# EAGLE schematic rgb-32x16-board (EAGLE 9.4.2)
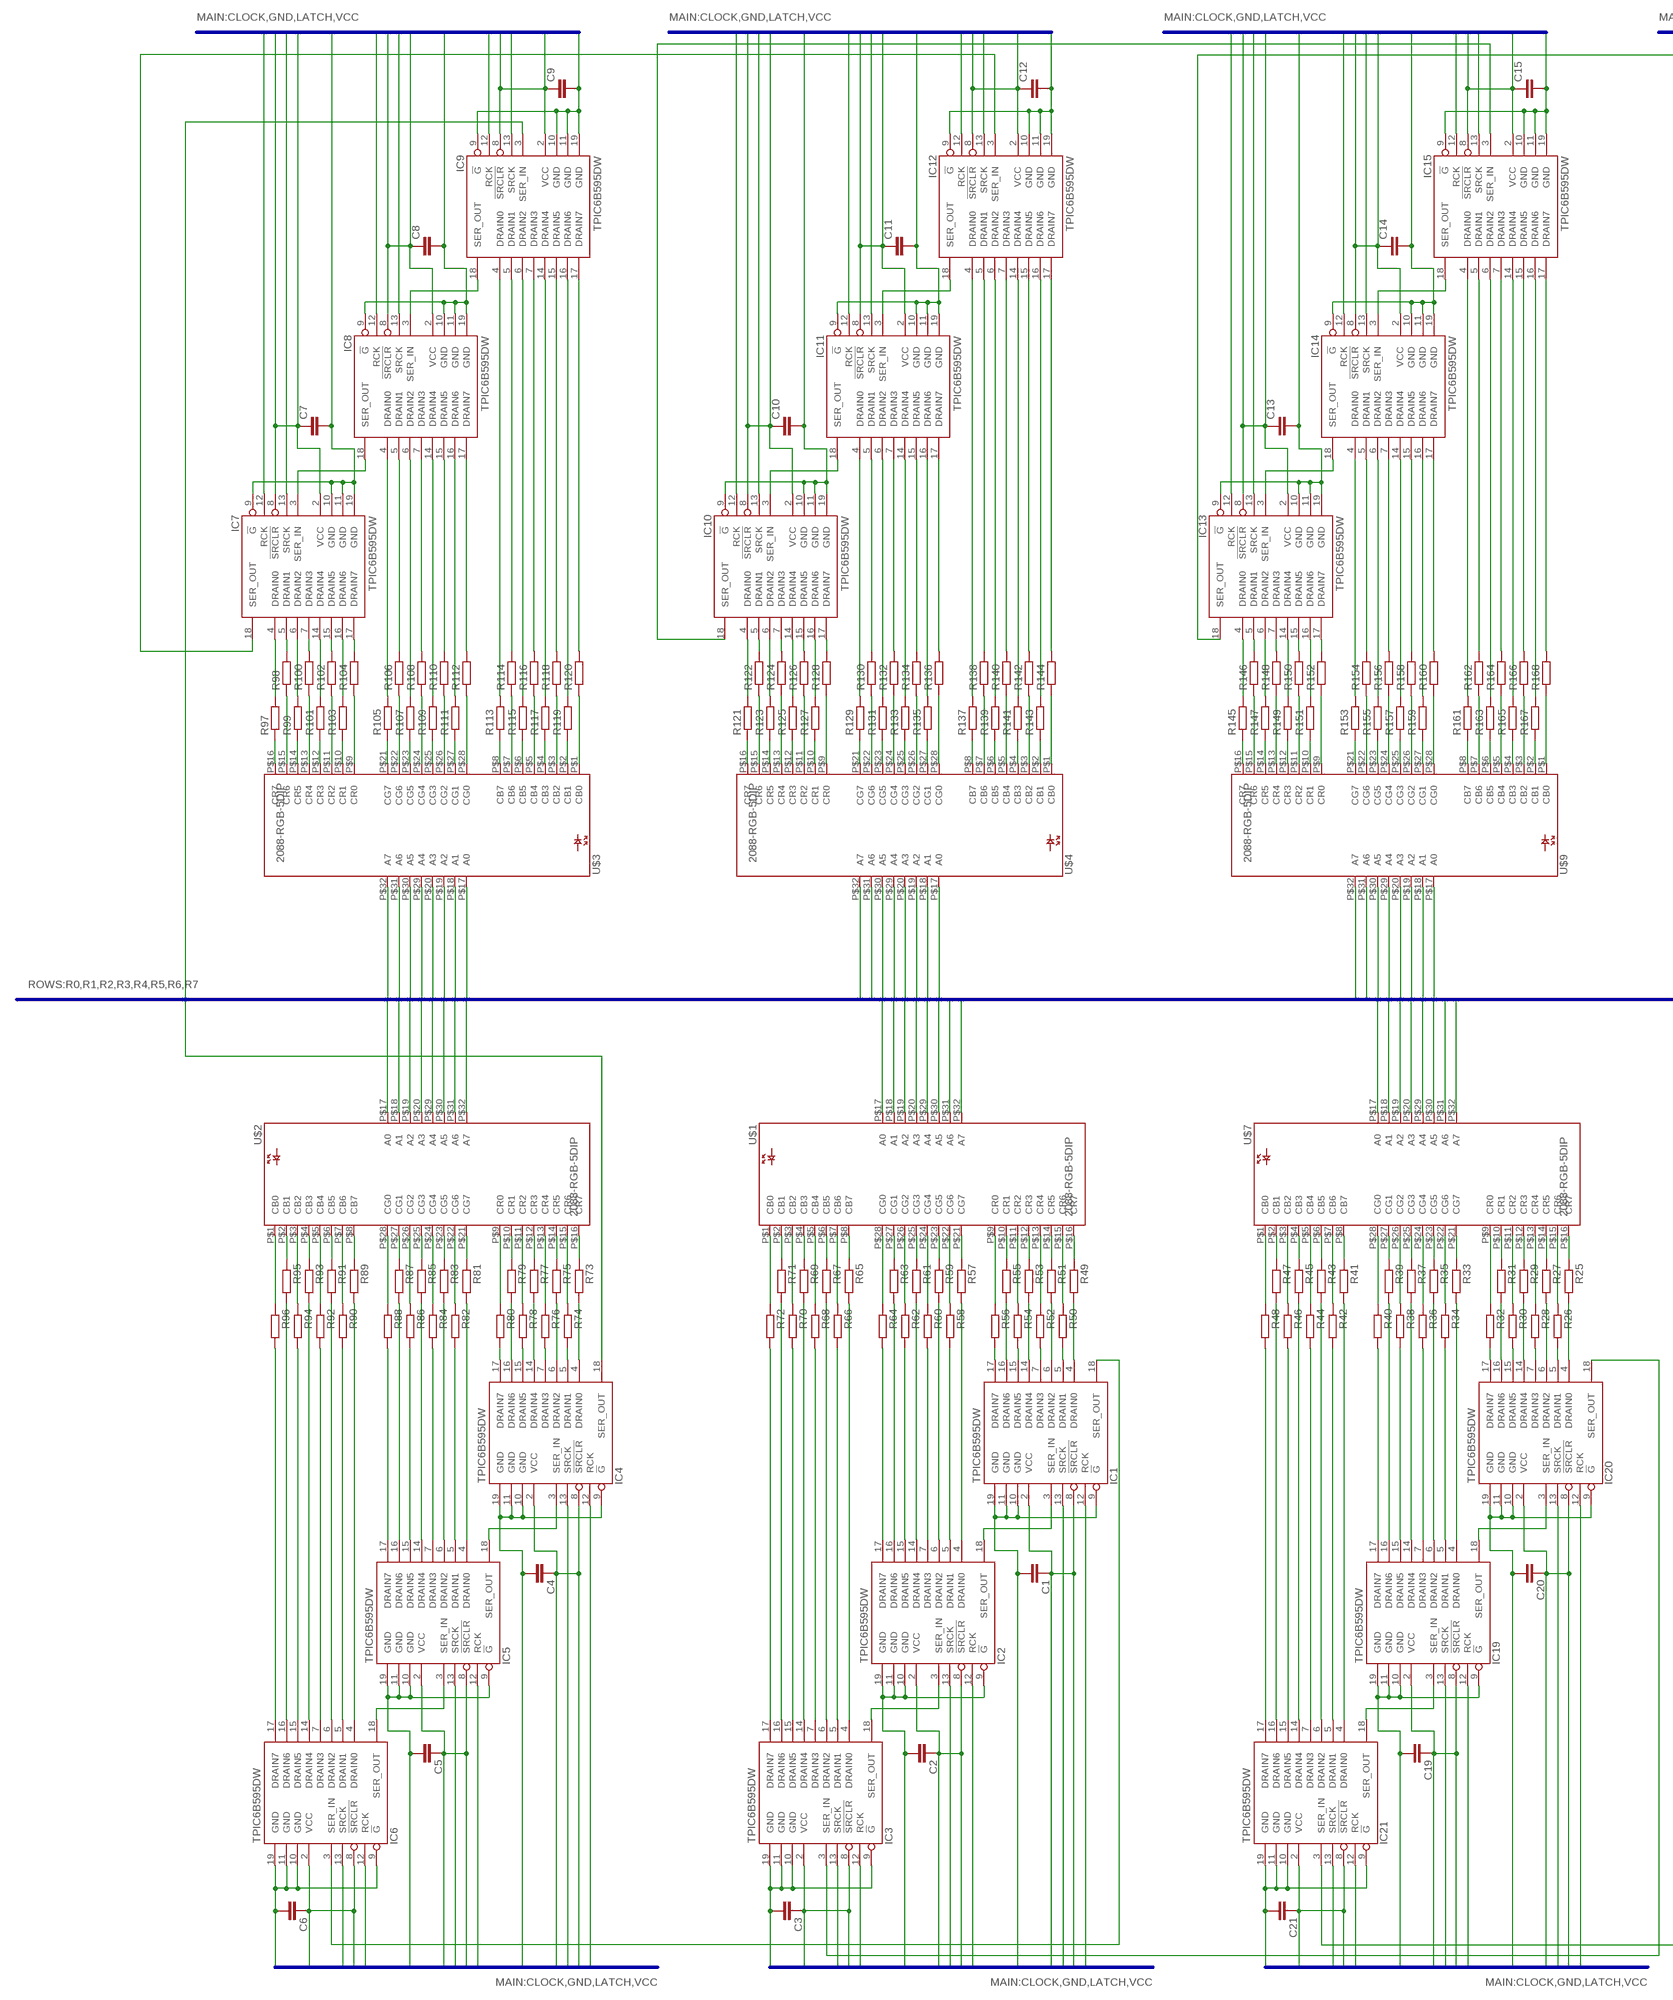
[diagram p0: schematic, sheet 1, part 1 of 2]
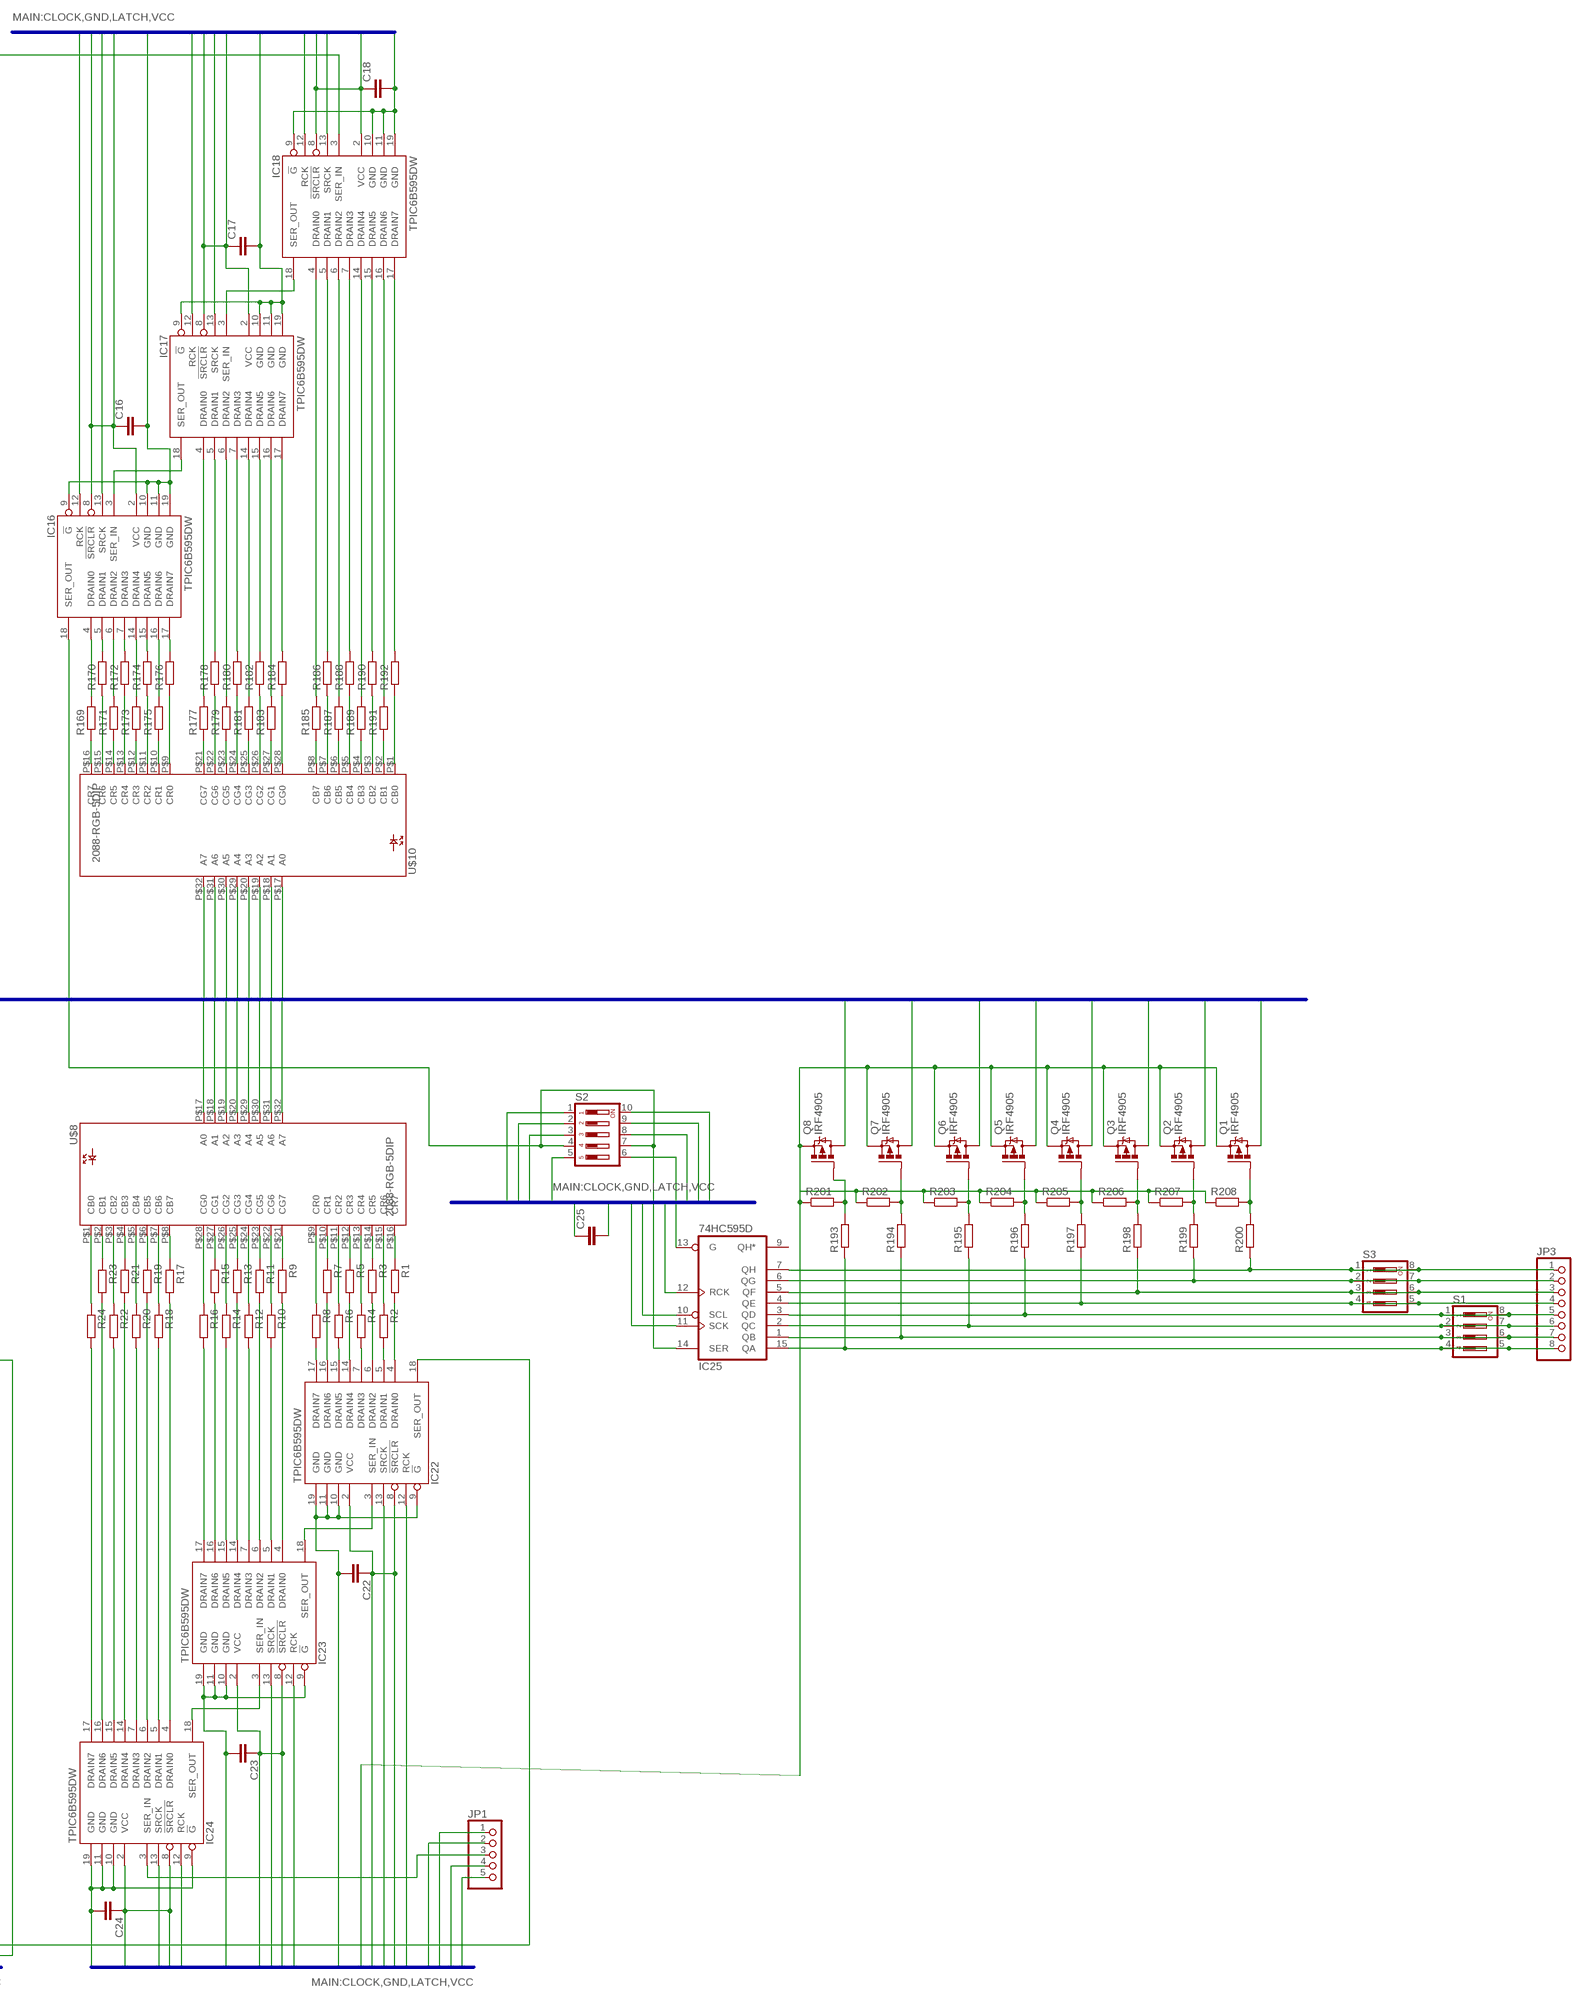
[diagram p1: schematic, sheet 1, part 2 of 2]

## Parts
C1  C-EUC1206  [C1206]
C2  C-EUC1206  [C1206]
C3  C-EUC1206  [C1206]
C4  C-EUC1206  [C1206]
C5  C-EUC1206  [C1206]
C6  C-EUC1206  [C1206]
C7  C-EUC1206  [C1206]
C8  C-EUC1206  [C1206]
C9  C-EUC1206  [C1206]
C10  C-EUC1206  [C1206]
C11  C-EUC1206  [C1206]
C12  C-EUC1206  [C1206]
C13  C-EUC1206  [C1206]
C14  C-EUC1206  [C1206]
C15  C-EUC1206  [C1206]
C16  C-EUC1206  [C1206]
C17  C-EUC1206  [C1206]
C18  C-EUC1206  [C1206]
C19  C-EUC1206  [C1206]
C20  C-EUC1206  [C1206]
C21  C-EUC1206  [C1206]
C22  C-EUC1206  [C1206]
C23  C-EUC1206  [C1206]
C24  C-EUC1206  [C1206]
C25  C-EUC1206  [C1206]
IC1  TPIC6B595DW  [SO20W]
IC2  TPIC6B595DW  [SO20W]
IC3  TPIC6B595DW  [SO20W]
IC4  TPIC6B595DW  [SO20W]
IC5  TPIC6B595DW  [SO20W]
IC6  TPIC6B595DW  [SO20W]
IC7  TPIC6B595DW  [SO20W]
IC8  TPIC6B595DW  [SO20W]
IC9  TPIC6B595DW  [SO20W]
IC10  TPIC6B595DW  [SO20W]
IC11  TPIC6B595DW  [SO20W]
IC12  TPIC6B595DW  [SO20W]
IC13  TPIC6B595DW  [SO20W]
IC14  TPIC6B595DW  [SO20W]
IC15  TPIC6B595DW  [SO20W]
IC16  TPIC6B595DW  [SO20W]
IC17  TPIC6B595DW  [SO20W]
IC18  TPIC6B595DW  [SO20W]
IC19  TPIC6B595DW  [SO20W]
IC20  TPIC6B595DW  [SO20W]
IC21  TPIC6B595DW  [SO20W]
IC22  TPIC6B595DW  [SO20W]
IC23  TPIC6B595DW  [SO20W]
IC24  TPIC6B595DW  [SO20W]
IC25  74HC595D  [SO16]
JP1  PINHD-1X5/90  [1X05/90]
JP3  PINHD-1X8/90  [1X08/90]
Q1  IRF4905  [TO220BH]
Q2  IRF4905  [TO220BH]
Q3  IRF4905  [TO220BH]
Q4  IRF4905  [TO220BH]
Q5  IRF4905  [TO220BH]
Q6  IRF4905  [TO220BH]
Q7  IRF4905  [TO220BH]
Q8  IRF4905  [TO220BH]
R1  R-EU_R1206  [R1206]
R2  R-EU_R1206  [R1206]
R3  R-EU_R1206  [R1206]
R4  R-EU_R1206  [R1206]
R5  R-EU_R1206  [R1206]
R6  R-EU_R1206  [R1206]
R7  R-EU_R1206  [R1206]
R8  R-EU_R1206  [R1206]
R9  R-EU_R1206  [R1206]
R10  R-EU_R1206  [R1206]
R11  R-EU_R1206  [R1206]
R12  R-EU_R1206  [R1206]
R13  R-EU_R1206  [R1206]
R14  R-EU_R1206  [R1206]
R15  R-EU_R1206  [R1206]
R16  R-EU_R1206  [R1206]
R17  R-EU_R1206  [R1206]
R18  R-EU_R1206  [R1206]
R19  R-EU_R1206  [R1206]
R20  R-EU_R1206  [R1206]
R21  R-EU_R1206  [R1206]
R22  R-EU_R1206  [R1206]
R23  R-EU_R1206  [R1206]
R24  R-EU_R1206  [R1206]
R25  R-EU_R1206  [R1206]
R26  R-EU_R1206  [R1206]
R27  R-EU_R1206  [R1206]
R28  R-EU_R1206  [R1206]
R29  R-EU_R1206  [R1206]
R30  R-EU_R1206  [R1206]
R31  R-EU_R1206  [R1206]
R32  R-EU_R1206  [R1206]
R33  R-EU_R1206  [R1206]
R34  R-EU_R1206  [R1206]
R35  R-EU_R1206  [R1206]
R36  R-EU_R1206  [R1206]
R37  R-EU_R1206  [R1206]
R38  R-EU_R1206  [R1206]
R39  R-EU_R1206  [R1206]
R40  R-EU_R1206  [R1206]
R41  R-EU_R1206  [R1206]
R42  R-EU_R1206  [R1206]
R43  R-EU_R1206  [R1206]
R44  R-EU_R1206  [R1206]
R45  R-EU_R1206  [R1206]
R46  R-EU_R1206  [R1206]
R47  R-EU_R1206  [R1206]
R48  R-EU_R1206  [R1206]
R49  R-EU_R1206  [R1206]
R50  R-EU_R1206  [R1206]
R51  R-EU_R1206  [R1206]
R52  R-EU_R1206  [R1206]
R53  R-EU_R1206  [R1206]
R54  R-EU_R1206  [R1206]
R55  R-EU_R1206  [R1206]
R56  R-EU_R1206  [R1206]
R57  R-EU_R1206  [R1206]
R58  R-EU_R1206  [R1206]
R59  R-EU_R1206  [R1206]
R60  R-EU_R1206  [R1206]
R61  R-EU_R1206  [R1206]
R62  R-EU_R1206  [R1206]
R63  R-EU_R1206  [R1206]
R64  R-EU_R1206  [R1206]
R65  R-EU_R1206  [R1206]
R66  R-EU_R1206  [R1206]
R67  R-EU_R1206  [R1206]
R68  R-EU_R1206  [R1206]
R69  R-EU_R1206  [R1206]
R70  R-EU_R1206  [R1206]
R71  R-EU_R1206  [R1206]
R72  R-EU_R1206  [R1206]
R73  R-EU_R1206  [R1206]
R74  R-EU_R1206  [R1206]
R75  R-EU_R1206  [R1206]
R76  R-EU_R1206  [R1206]
R77  R-EU_R1206  [R1206]
R78  R-EU_R1206  [R1206]
R79  R-EU_R1206  [R1206]
R80  R-EU_R1206  [R1206]
R81  R-EU_R1206  [R1206]
R82  R-EU_R1206  [R1206]
R83  R-EU_R1206  [R1206]
R84  R-EU_R1206  [R1206]
R85  R-EU_R1206  [R1206]
R86  R-EU_R1206  [R1206]
R87  R-EU_R1206  [R1206]
R88  R-EU_R1206  [R1206]
R89  R-EU_R1206  [R1206]
R90  R-EU_R1206  [R1206]
R91  R-EU_R1206  [R1206]
R92  R-EU_R1206  [R1206]
R93  R-EU_R1206  [R1206]
R94  R-EU_R1206  [R1206]
R95  R-EU_R1206  [R1206]
R96  R-EU_R1206  [R1206]
R97  R-EU_R1206  [R1206]
R98  R-EU_R1206  [R1206]
R99  R-EU_R1206  [R1206]
R100  R-EU_R1206  [R1206]
R101  R-EU_R1206  [R1206]
R102  R-EU_R1206  [R1206]
R103  R-EU_R1206  [R1206]
R104  R-EU_R1206  [R1206]
R105  R-EU_R1206  [R1206]
R106  R-EU_R1206  [R1206]
R107  R-EU_R1206  [R1206]
R108  R-EU_R1206  [R1206]
R109  R-EU_R1206  [R1206]
R110  R-EU_R1206  [R1206]
R111  R-EU_R1206  [R1206]
R112  R-EU_R1206  [R1206]
R113  R-EU_R1206  [R1206]
R114  R-EU_R1206  [R1206]
R115  R-EU_R1206  [R1206]
R116  R-EU_R1206  [R1206]
R117  R-EU_R1206  [R1206]
R118  R-EU_R1206  [R1206]
R119  R-EU_R1206  [R1206]
R120  R-EU_R1206  [R1206]
R121  R-EU_R1206  [R1206]
R122  R-EU_R1206  [R1206]
R123  R-EU_R1206  [R1206]
R124  R-EU_R1206  [R1206]
R125  R-EU_R1206  [R1206]
R126  R-EU_R1206  [R1206]
R127  R-EU_R1206  [R1206]
R128  R-EU_R1206  [R1206]
R129  R-EU_R1206  [R1206]
R130  R-EU_R1206  [R1206]
R131  R-EU_R1206  [R1206]
R132  R-EU_R1206  [R1206]
R133  R-EU_R1206  [R1206]
R134  R-EU_R1206  [R1206]
R135  R-EU_R1206  [R1206]
R136  R-EU_R1206  [R1206]
R137  R-EU_R1206  [R1206]
R138  R-EU_R1206  [R1206]
R139  R-EU_R1206  [R1206]
R140  R-EU_R1206  [R1206]
R141  R-EU_R1206  [R1206]
R142  R-EU_R1206  [R1206]
R143  R-EU_R1206  [R1206]
R144  R-EU_R1206  [R1206]
R145  R-EU_R1206  [R1206]
R146  R-EU_R1206  [R1206]
R147  R-EU_R1206  [R1206]
R148  R-EU_R1206  [R1206]
R149  R-EU_R1206  [R1206]
R150  R-EU_R1206  [R1206]
R151  R-EU_R1206  [R1206]
R152  R-EU_R1206  [R1206]
R153  R-EU_R1206  [R1206]
R154  R-EU_R1206  [R1206]
R155  R-EU_R1206  [R1206]
R156  R-EU_R1206  [R1206]
R157  R-EU_R1206  [R1206]
R158  R-EU_R1206  [R1206]
R159  R-EU_R1206  [R1206]
R160  R-EU_R1206  [R1206]
R161  R-EU_R1206  [R1206]
R162  R-EU_R1206  [R1206]
R163  R-EU_R1206  [R1206]
R164  R-EU_R1206  [R1206]
R165  R-EU_R1206  [R1206]
R166  R-EU_R1206  [R1206]
R167  R-EU_R1206  [R1206]
R168  R-EU_R1206  [R1206]
R169  R-EU_R1206  [R1206]
R170  R-EU_R1206  [R1206]
R171  R-EU_R1206  [R1206]
R172  R-EU_R1206  [R1206]
R173  R-EU_R1206  [R1206]
R174  R-EU_R1206  [R1206]
R175  R-EU_R1206  [R1206]
R176  R-EU_R1206  [R1206]
R177  R-EU_R1206  [R1206]
R178  R-EU_R1206  [R1206]
R179  R-EU_R1206  [R1206]
R180  R-EU_R1206  [R1206]
R181  R-EU_R1206  [R1206]
R182  R-EU_R1206  [R1206]
R183  R-EU_R1206  [R1206]
R184  R-EU_R1206  [R1206]
R185  R-EU_R1206  [R1206]
R186  R-EU_R1206  [R1206]
R187  R-EU_R1206  [R1206]
R188  R-EU_R1206  [R1206]
R189  R-EU_R1206  [R1206]
R190  R-EU_R1206  [R1206]
R191  R-EU_R1206  [R1206]
R192  R-EU_R1206  [R1206]
R193  R-EU_0207/10  [0207/10]
R194  R-EU_0207/10  [0207/10]
R195  R-EU_0207/10  [0207/10]
R196  R-EU_0207/10  [0207/10]
R197  R-EU_0207/10  [0207/10]
R198  R-EU_0207/10  [0207/10]
R199  R-EU_0207/10  [0207/10]
R200  R-EU_0207/10  [0207/10]
R201  R-EU_R1206  [R1206]
R202  R-EU_R1206  [R1206]
R203  R-EU_R1206  [R1206]
R204  R-EU_R1206  [R1206]
R205  R-EU_R1206  [R1206]
R206  R-EU_R1206  [R1206]
R207  R-EU_R1206  [R1206]
R208  R-EU_R1206  [R1206]
S1  DIP04YL  [DIP04YL]
S2  DIP05YL  [DIP05YL]
S3  DIP04YL  [DIP04YL]
U$1  2088-RGB-5DIP  [2088-RGB-5]
U$2  2088-RGB-5DIP  [2088-RGB-5]
U$3  2088-RGB-5DIP  [2088-RGB-5]
U$4  2088-RGB-5DIP  [2088-RGB-5]
U$7  2088-RGB-5DIP  [2088-RGB-5]
U$8  2088-RGB-5DIP  [2088-RGB-5]
U$9  2088-RGB-5DIP  [2088-RGB-5]
U$10  2088-RGB-5DIP  [2088-RGB-5]

## Nets
CLOCK: IC1.13(SRCK) IC2.13(SRCK) IC3.13(SRCK) IC4.13(SRCK) IC5.13(SRCK) IC6.13(SRCK) IC7.13(SRCK) IC8.13(SRCK) IC9.13(SRCK) IC10.13(SRCK) IC11.13(SRCK) IC12.13(SRCK) IC13.13(SRCK) IC14.13(SRCK) IC15.13(SRCK) IC16.13(SRCK) IC17.13(SRCK) IC18.13(SRCK) IC19.13(SRCK) IC20.13(SRCK) IC21.13(SRCK) IC22.13(SRCK) IC23.13(SRCK) IC24.13(SRCK) IC25.11(SCK) JP1.2 S2.2 S2.9
GND: C1.2 C2.2 C3.2 C4.2 C5.2 C6.2 C7.2 C8.2 C9.2 C10.2 C11.2 C12.2 C13.2 C14.2 C15.2 C16.2 C17.2 C18.2 C19.2 C20.2 C21.2 C22.2 C23.2 C24.2 C25.2 IC1.9(!G) IC1.10(GND) IC1.11(GND) IC1.19(GND) IC2.9(!G) IC2.10(GND) IC2.11(GND) IC2.19(GND) IC3.9(!G) IC3.10(GND) IC3.11(GND) IC3.19(GND) IC4.9(!G) IC4.10(GND) IC4.11(GND) IC4.19(GND) IC5.9(!G) IC5.10(GND) IC5.11(GND) IC5.19(GND) IC6.9(!G) IC6.10(GND) IC6.11(GND) IC6.19(GND) IC7.9(!G) IC7.10(GND) IC7.11(GND) IC7.19(GND) IC8.9(!G) IC8.10(GND) IC8.11(GND) IC8.19(GND) IC9.9(!G) IC9.10(GND) IC9.11(GND) IC9.19(GND) IC10.9(!G) IC10.10(GND) IC10.11(GND) IC10.19(GND) IC11.9(!G) IC11.10(GND) IC11.11(GND) IC11.19(GND) IC12.9(!G) IC12.10(GND) IC12.11(GND) IC12.19(GND) IC13.9(!G) IC13.10(GND) IC13.11(GND) IC13.19(GND) IC14.9(!G) IC14.10(GND) IC14.11(GND) IC14.19(GND) IC15.9(!G) IC15.10(GND) IC15.11(GND) IC15.19(GND) IC16.9(!G) IC16.10(GND) IC16.11(GND) IC16.19(GND) IC17.9(!G) IC17.10(GND) IC17.11(GND) IC17.19(GND) IC18.9(!G) IC18.10(GND) IC18.11(GND) IC18.19(GND) IC19.9(!G) IC19.10(GND) IC19.11(GND) IC19.19(GND) IC20.9(!G) IC20.10(GND) IC20.11(GND) IC20.19(GND) IC21.9(!G) IC21.10(GND) IC21.11(GND) IC21.19(GND) IC22.9(!G) IC22.10(GND) IC22.11(GND) IC22.19(GND) IC23.9(!G) IC23.10(GND) IC23.11(GND) IC23.19(GND) IC24.9(!G) IC24.10(GND) IC24.11(GND) IC24.19(GND) IC25.13(G) JP1.5 S2.1 S2.10
LATCH: IC1.12(RCK) IC2.12(RCK) IC3.12(RCK) IC4.12(RCK) IC5.12(RCK) IC6.12(RCK) IC7.12(RCK) IC8.12(RCK) IC9.12(RCK) IC10.12(RCK) IC11.12(RCK) IC12.12(RCK) IC13.12(RCK) IC14.12(RCK) IC15.12(RCK) IC16.12(RCK) IC17.12(RCK) IC18.12(RCK) IC19.12(RCK) IC20.12(RCK) IC21.12(RCK) IC22.12(RCK) IC23.12(RCK) IC24.12(RCK) IC25.12(RCK) JP1.1 S2.3 S2.8
N$1: R1.1 U$8.P$16(CR7)
N$2: R3.1 U$8.P$14(CR5)
N$3: R5.1 U$8.P$12(CR3)
N$4: R7.1 U$8.P$10(CR1)
N$5: R9.1 U$8.P$21(CG7)
N$6: R11.1 U$8.P$23(CG5)
N$7: R13.1 U$8.P$25(CG3)
N$8: R15.1 U$8.P$27(CG1)
N$9: IC22.17(DRAIN7) R8.2
N$10: IC22.16(DRAIN6) R7.2
N$11: IC22.15(DRAIN5) R6.2
N$12: IC22.14(DRAIN4) R5.2
N$13: IC22.7(DRAIN3) R4.2
N$14: IC22.6(DRAIN2) R3.2
N$15: IC22.5(DRAIN1) R2.2
N$16: IC22.4(DRAIN0) R1.2
N$17: IC23.4(DRAIN0) R9.2
N$18: IC23.5(DRAIN1) R10.2
N$19: IC23.6(DRAIN2) R11.2
N$20: IC23.7(DRAIN3) R12.2
N$21: IC23.14(DRAIN4) R13.2
N$22: IC23.15(DRAIN5) R14.2
N$23: IC23.16(DRAIN6) R15.2
N$24: IC23.17(DRAIN7) R16.2
N$25: IC24.4(DRAIN0) R17.2
N$26: IC24.5(DRAIN1) R18.2
N$27: IC24.6(DRAIN2) R19.2
N$28: IC24.7(DRAIN3) R20.2
N$29: IC24.14(DRAIN4) R21.2
N$30: IC24.15(DRAIN5) R22.2
N$31: IC24.16(DRAIN6) R23.2
N$32: IC24.17(DRAIN7) R24.2
N$33: R17.1 U$8.P$8(CB7)
N$34: R19.1 U$8.P$6(CB5)
N$35: R21.1 U$8.P$4(CB3)
N$36: R23.1 U$8.P$2(CB1)
N$37: R2.1 U$8.P$15(CR6)
N$38: R4.1 U$8.P$13(CR4)
N$39: R6.1 U$8.P$11(CR2)
N$40: R8.1 U$8.P$9(CR0)
N$41: R10.1 U$8.P$22(CG6)
N$42: R12.1 U$8.P$24(CG4)
N$43: R14.1 U$8.P$26(CG2)
N$44: R16.1 U$8.P$28(CG0)
N$45: R18.1 U$8.P$7(CB6)
N$46: R20.1 U$8.P$5(CB4)
N$47: R22.1 U$8.P$3(CB2)
N$48: R24.1 U$8.P$1(CB0)
N$49: IC21.3(SER_IN) IC22.18(SER_OUT)
N$50: IC22.3(SER_IN) IC23.18(SER_OUT)
N$51: IC20.17(DRAIN7) R32.2
N$52: IC23.3(SER_IN) IC24.18(SER_OUT)
N$53: IC24.3(SER_IN) JP1.3
N$54: IC20.16(DRAIN6) R31.2
N$55: IC20.15(DRAIN5) R30.2
N$56: IC20.14(DRAIN4) R29.2
N$57: IC20.7(DRAIN3) R28.2
N$58: IC20.6(DRAIN2) R27.2
N$59: IC20.5(DRAIN1) R26.2
N$60: IC20.4(DRAIN0) R25.2
N$61: IC19.4(DRAIN0) R33.2
N$62: IC19.5(DRAIN1) R34.2
N$63: IC19.6(DRAIN2) R35.2
N$64: IC19.7(DRAIN3) R36.2
N$65: IC19.14(DRAIN4) R37.2
N$66: IC19.15(DRAIN5) R38.2
N$67: IC19.16(DRAIN6) R39.2
N$68: IC19.17(DRAIN7) R40.2
N$69: IC21.4(DRAIN0) R41.2
N$70: IC21.5(DRAIN1) R42.2
N$71: IC21.6(DRAIN2) R43.2
N$72: IC21.7(DRAIN3) R44.2
N$73: IC21.14(DRAIN4) R45.2
N$74: IC21.15(DRAIN5) R46.2
N$75: IC21.16(DRAIN6) R47.2
N$76: IC21.17(DRAIN7) R48.2
N$77: R25.1 U$7.P$16(CR7)
N$78: R27.1 U$7.P$14(CR5)
N$79: R29.1 U$7.P$12(CR3)
N$80: R31.1 U$7.P$10(CR1)
N$81: R33.1 U$7.P$21(CG7)
N$82: R35.1 U$7.P$23(CG5)
N$83: R37.1 U$7.P$25(CG3)
N$84: R39.1 U$7.P$27(CG1)
N$85: R41.1 U$7.P$8(CB7)
N$86: R43.1 U$7.P$6(CB5)
N$87: R45.1 U$7.P$4(CB3)
N$88: R47.1 U$7.P$2(CB1)
N$89: R26.1 U$7.P$15(CR6)
N$90: R28.1 U$7.P$13(CR4)
N$91: R30.1 U$7.P$11(CR2)
N$92: R32.1 U$7.P$9(CR0)
N$93: R34.1 U$7.P$22(CG6)
N$94: R36.1 U$7.P$24(CG4)
N$95: R38.1 U$7.P$26(CG2)
N$96: R40.1 U$7.P$28(CG0)
N$97: R42.1 U$7.P$7(CB6)
N$98: R44.1 U$7.P$5(CB4)
N$99: R46.1 U$7.P$3(CB2)
N$100: R48.1 U$7.P$1(CB0)
N$101: IC19.3(SER_IN) IC21.18(SER_OUT)
N$102: IC19.18(SER_OUT) IC20.3(SER_IN)
N$103: IC3.3(SER_IN) IC20.18(SER_OUT)
N$104: IC1.17(DRAIN7) R56.2
N$105: IC1.16(DRAIN6) R55.2
N$106: IC1.15(DRAIN5) R54.2
N$107: IC1.14(DRAIN4) R53.2
N$108: IC1.7(DRAIN3) R52.2
N$109: IC1.6(DRAIN2) R51.2
N$110: IC1.5(DRAIN1) R50.2
N$111: IC1.4(DRAIN0) R49.2
N$112: IC2.4(DRAIN0) R57.2
N$113: IC2.5(DRAIN1) R58.2
N$114: IC2.6(DRAIN2) R59.2
N$115: IC2.7(DRAIN3) R60.2
N$116: IC2.14(DRAIN4) R61.2
N$117: IC2.15(DRAIN5) R62.2
N$118: IC2.16(DRAIN6) R63.2
N$119: IC2.17(DRAIN7) R64.2
N$120: IC3.4(DRAIN0) R65.2
N$121: IC3.5(DRAIN1) R66.2
N$122: IC3.6(DRAIN2) R67.2
N$123: IC3.7(DRAIN3) R68.2
N$124: IC3.14(DRAIN4) R69.2
N$125: IC3.15(DRAIN5) R70.2
N$126: IC3.16(DRAIN6) R71.2
N$127: IC3.17(DRAIN7) R72.2
N$128: IC1.18(SER_OUT) IC6.3(SER_IN)
N$129: R49.1 U$1.P$16(CR7)
N$130: R51.1 U$1.P$14(CR5)
N$131: R53.1 U$1.P$12(CR3)
N$132: R55.1 U$1.P$10(CR1)
N$133: R57.1 U$1.P$21(CG7)
N$134: R59.1 U$1.P$23(CG5)
N$135: R61.1 U$1.P$25(CG3)
N$136: R63.1 U$1.P$27(CG1)
N$137: R65.1 U$1.P$8(CB7)
N$138: R67.1 U$1.P$6(CB5)
N$139: R69.1 U$1.P$4(CB3)
N$140: R71.1 U$1.P$2(CB1)
N$141: R50.1 U$1.P$15(CR6)
N$142: R52.1 U$1.P$13(CR4)
N$143: R54.1 U$1.P$11(CR2)
N$144: R56.1 U$1.P$9(CR0)
N$145: R58.1 U$1.P$22(CG6)
N$146: R60.1 U$1.P$24(CG4)
N$147: R62.1 U$1.P$26(CG2)
N$148: R64.1 U$1.P$28(CG0)
N$149: R66.1 U$1.P$7(CB6)
N$150: R68.1 U$1.P$5(CB4)
N$151: R70.1 U$1.P$3(CB2)
N$152: R72.1 U$1.P$1(CB0)
N$153: IC2.3(SER_IN) IC3.18(SER_OUT)
N$154: IC4.17(DRAIN7) R80.2
N$155: IC1.3(SER_IN) IC2.18(SER_OUT)
N$156: IC4.16(DRAIN6) R79.2
N$157: IC4.15(DRAIN5) R78.2
N$158: IC4.14(DRAIN4) R77.2
N$159: IC4.7(DRAIN3) R76.2
N$160: IC4.6(DRAIN2) R75.2
N$161: IC4.5(DRAIN1) R74.2
N$162: IC4.4(DRAIN0) R73.2
N$163: IC5.4(DRAIN0) R81.2
N$164: IC5.5(DRAIN1) R82.2
N$165: IC5.6(DRAIN2) R83.2
N$166: IC5.7(DRAIN3) R84.2
N$167: IC5.14(DRAIN4) R85.2
N$168: IC5.15(DRAIN5) R86.2
N$169: IC5.16(DRAIN6) R87.2
N$170: IC5.17(DRAIN7) R88.2
N$171: IC6.4(DRAIN0) R89.2
N$172: IC6.5(DRAIN1) R90.2
N$173: IC6.6(DRAIN2) R91.2
N$174: IC6.7(DRAIN3) R92.2
N$175: IC6.14(DRAIN4) R93.2
N$176: IC6.15(DRAIN5) R94.2
N$177: IC6.16(DRAIN6) R95.2
N$178: IC6.17(DRAIN7) R96.2
N$179: R73.1 U$2.P$16(CR7)
N$180: R75.1 U$2.P$14(CR5)
N$181: R77.1 U$2.P$12(CR3)
N$182: R79.1 U$2.P$10(CR1)
N$183: R81.1 U$2.P$21(CG7)
N$184: R83.1 U$2.P$23(CG5)
N$185: R85.1 U$2.P$25(CG3)
N$186: R87.1 U$2.P$27(CG1)
N$187: R89.1 U$2.P$8(CB7)
N$188: R91.1 U$2.P$6(CB5)
N$189: R93.1 U$2.P$4(CB3)
N$190: R95.1 U$2.P$2(CB1)
N$191: R74.1 U$2.P$15(CR6)
N$192: R76.1 U$2.P$13(CR4)
N$193: R78.1 U$2.P$11(CR2)
N$194: R80.1 U$2.P$9(CR0)
N$195: R82.1 U$2.P$22(CG6)
N$196: R84.1 U$2.P$24(CG4)
N$197: R86.1 U$2.P$26(CG2)
N$198: R88.1 U$2.P$28(CG0)
N$199: R90.1 U$2.P$7(CB6)
N$200: R92.1 U$2.P$5(CB4)
N$201: R94.1 U$2.P$3(CB2)
N$202: R96.1 U$2.P$1(CB0)
N$203: IC5.3(SER_IN) IC6.18(SER_OUT)
N$204: IC4.3(SER_IN) IC5.18(SER_OUT)
N$205: IC7.17(DRAIN7) R104.2
N$206: IC7.16(DRAIN6) R103.2
N$207: IC7.15(DRAIN5) R102.2
N$208: IC7.14(DRAIN4) R101.2
N$209: IC7.7(DRAIN3) R100.2
N$210: IC7.6(DRAIN2) R99.2
N$211: IC7.5(DRAIN1) R98.2
N$212: IC7.4(DRAIN0) R97.2
N$213: IC8.4(DRAIN0) R105.2
N$214: IC8.5(DRAIN1) R106.2
N$215: IC8.6(DRAIN2) R107.2
N$216: IC8.7(DRAIN3) R108.2
N$217: IC8.14(DRAIN4) R109.2
N$218: IC8.15(DRAIN5) R110.2
N$219: IC8.16(DRAIN6) R111.2
N$220: IC8.17(DRAIN7) R112.2
N$221: IC9.4(DRAIN0) R113.2
N$222: IC9.5(DRAIN1) R114.2
N$223: IC9.6(DRAIN2) R115.2
N$224: IC9.7(DRAIN3) R116.2
N$225: IC9.14(DRAIN4) R117.2
N$226: IC9.15(DRAIN5) R118.2
N$227: IC9.16(DRAIN6) R119.2
N$228: IC9.17(DRAIN7) R120.2
N$229: IC4.18(SER_OUT) IC9.3(SER_IN)
N$230: R97.1 U$3.P$16(CR7)
N$231: R99.1 U$3.P$14(CR5)
N$232: R101.1 U$3.P$12(CR3)
N$233: R103.1 U$3.P$10(CR1)
N$234: R105.1 U$3.P$21(CG7)
N$235: R107.1 U$3.P$23(CG5)
N$236: R109.1 U$3.P$25(CG3)
N$237: R111.1 U$3.P$27(CG1)
N$238: R113.1 U$3.P$8(CB7)
N$239: R115.1 U$3.P$6(CB5)
N$240: R117.1 U$3.P$4(CB3)
N$241: R119.1 U$3.P$2(CB1)
N$242: R98.1 U$3.P$15(CR6)
N$243: R100.1 U$3.P$13(CR4)
N$244: R102.1 U$3.P$11(CR2)
N$245: R104.1 U$3.P$9(CR0)
N$246: R106.1 U$3.P$22(CG6)
N$247: R108.1 U$3.P$24(CG4)
N$248: R110.1 U$3.P$26(CG2)
N$249: R112.1 U$3.P$28(CG0)
N$250: R114.1 U$3.P$7(CB6)
N$251: R116.1 U$3.P$5(CB4)
N$252: R118.1 U$3.P$3(CB2)
N$253: R120.1 U$3.P$1(CB0)
N$254: IC10.17(DRAIN7) R128.2
N$255: IC10.16(DRAIN6) R127.2
N$256: IC10.15(DRAIN5) R126.2
N$257: IC10.14(DRAIN4) R125.2
N$258: IC10.7(DRAIN3) R124.2
N$259: IC10.6(DRAIN2) R123.2
N$260: IC10.5(DRAIN1) R122.2
N$261: IC10.4(DRAIN0) R121.2
N$262: IC11.4(DRAIN0) R129.2
N$263: IC11.5(DRAIN1) R130.2
N$264: IC11.6(DRAIN2) R131.2
N$265: IC11.7(DRAIN3) R132.2
N$266: IC11.14(DRAIN4) R133.2
N$267: IC11.15(DRAIN5) R134.2
N$268: IC11.16(DRAIN6) R135.2
N$269: IC11.17(DRAIN7) R136.2
N$270: IC12.4(DRAIN0) R137.2
N$271: IC12.5(DRAIN1) R138.2
N$272: IC12.6(DRAIN2) R139.2
N$273: IC12.7(DRAIN3) R140.2
N$274: IC12.14(DRAIN4) R141.2
N$275: IC12.15(DRAIN5) R142.2
N$276: IC12.16(DRAIN6) R143.2
N$277: IC12.17(DRAIN7) R144.2
N$278: IC7.18(SER_OUT) IC12.3(SER_IN)
N$279: IC7.3(SER_IN) IC8.18(SER_OUT)
N$280: IC8.3(SER_IN) IC9.18(SER_OUT)
N$281: R121.1 U$4.P$16(CR7)
N$282: R123.1 U$4.P$14(CR5)
N$283: R125.1 U$4.P$12(CR3)
N$284: R127.1 U$4.P$10(CR1)
N$285: R129.1 U$4.P$21(CG7)
N$286: R131.1 U$4.P$23(CG5)
N$287: R133.1 U$4.P$25(CG3)
N$288: R135.1 U$4.P$27(CG1)
N$289: R137.1 U$4.P$8(CB7)
N$290: R139.1 U$4.P$6(CB5)
N$291: R141.1 U$4.P$4(CB3)
N$292: R143.1 U$4.P$2(CB1)
N$293: R122.1 U$4.P$15(CR6)
N$294: R124.1 U$4.P$13(CR4)
N$295: R126.1 U$4.P$11(CR2)
N$296: R128.1 U$4.P$9(CR0)
N$297: R130.1 U$4.P$22(CG6)
N$298: R132.1 U$4.P$24(CG4)
N$299: R134.1 U$4.P$26(CG2)
N$300: R136.1 U$4.P$28(CG0)
N$301: R138.1 U$4.P$7(CB6)
N$302: R140.1 U$4.P$5(CB4)
N$303: R142.1 U$4.P$3(CB2)
N$304: R144.1 U$4.P$1(CB0)
N$305: IC11.3(SER_IN) IC12.18(SER_OUT)
N$306: IC10.18(SER_OUT) IC15.3(SER_IN)
N$307: IC10.3(SER_IN) IC11.18(SER_OUT)
N$308: IC13.17(DRAIN7) R152.2
N$309: IC13.16(DRAIN6) R151.2
N$310: IC13.15(DRAIN5) R150.2
N$311: IC13.14(DRAIN4) R149.2
N$312: IC13.7(DRAIN3) R148.2
N$313: IC13.6(DRAIN2) R147.2
N$314: IC13.5(DRAIN1) R146.2
N$315: IC13.4(DRAIN0) R145.2
N$316: IC14.4(DRAIN0) R153.2
N$317: IC14.5(DRAIN1) R154.2
N$318: IC14.6(DRAIN2) R155.2
N$319: IC14.7(DRAIN3) R156.2
N$320: IC14.14(DRAIN4) R157.2
N$321: IC14.15(DRAIN5) R158.2
N$322: IC14.16(DRAIN6) R159.2
N$323: IC14.17(DRAIN7) R160.2
N$324: IC15.4(DRAIN0) R161.2
N$325: IC15.5(DRAIN1) R162.2
N$326: IC15.6(DRAIN2) R163.2
N$327: IC15.7(DRAIN3) R164.2
N$328: IC15.14(DRAIN4) R165.2
N$329: IC15.15(DRAIN5) R166.2
N$330: IC15.16(DRAIN6) R167.2
N$331: IC15.17(DRAIN7) R168.2
N$332: R145.1 U$9.P$16(CR7)
N$333: R147.1 U$9.P$14(CR5)
N$334: R149.1 U$9.P$12(CR3)
N$335: R151.1 U$9.P$10(CR1)
N$336: R153.1 U$9.P$21(CG7)
N$337: R155.1 U$9.P$23(CG5)
N$338: R157.1 U$9.P$25(CG3)
N$339: R159.1 U$9.P$27(CG1)
N$340: R161.1 U$9.P$8(CB7)
N$341: R163.1 U$9.P$6(CB5)
N$342: R165.1 U$9.P$4(CB3)
N$343: R167.1 U$9.P$2(CB1)
N$344: R146.1 U$9.P$15(CR6)
N$345: R148.1 U$9.P$13(CR4)
N$346: R150.1 U$9.P$11(CR2)
N$347: R152.1 U$9.P$9(CR0)
N$348: R154.1 U$9.P$22(CG6)
N$349: R156.1 U$9.P$24(CG4)
N$350: R158.1 U$9.P$26(CG2)
N$351: R160.1 U$9.P$28(CG0)
N$352: R162.1 U$9.P$7(CB6)
N$353: R164.1 U$9.P$5(CB4)
N$354: R166.1 U$9.P$3(CB2)
N$355: R168.1 U$9.P$1(CB0)
N$356: IC14.3(SER_IN) IC15.18(SER_OUT)
N$357: IC13.3(SER_IN) IC14.18(SER_OUT)
N$358: IC16.17(DRAIN7) R176.2
N$359: IC16.16(DRAIN6) R175.2
N$360: IC16.15(DRAIN5) R174.2
N$361: IC16.14(DRAIN4) R173.2
N$362: IC16.7(DRAIN3) R172.2
N$363: IC16.6(DRAIN2) R171.2
N$364: IC16.5(DRAIN1) R170.2
N$365: IC16.4(DRAIN0) R169.2
N$366: IC17.4(DRAIN0) R177.2
N$367: IC17.5(DRAIN1) R178.2
N$368: IC17.6(DRAIN2) R179.2
N$369: IC17.7(DRAIN3) R180.2
N$370: IC17.14(DRAIN4) R181.2
N$371: IC17.15(DRAIN5) R182.2
N$372: IC17.16(DRAIN6) R183.2
N$373: IC17.17(DRAIN7) R184.2
N$374: IC18.4(DRAIN0) R185.2
N$375: IC18.5(DRAIN1) R186.2
N$376: IC18.6(DRAIN2) R187.2
N$377: IC18.7(DRAIN3) R188.2
N$378: IC18.14(DRAIN4) R189.2
N$379: IC18.15(DRAIN5) R190.2
N$380: IC18.16(DRAIN6) R191.2
N$381: IC18.17(DRAIN7) R192.2
N$382: R169.1 U$10.P$16(CR7)
N$383: R171.1 U$10.P$14(CR5)
N$384: R173.1 U$10.P$12(CR3)
N$385: R175.1 U$10.P$10(CR1)
N$386: R177.1 U$10.P$21(CG7)
N$387: R179.1 U$10.P$23(CG5)
N$388: R181.1 U$10.P$25(CG3)
N$389: R183.1 U$10.P$27(CG1)
N$390: R185.1 U$10.P$8(CB7)
N$391: R187.1 U$10.P$6(CB5)
N$392: R189.1 U$10.P$4(CB3)
N$393: R191.1 U$10.P$2(CB1)
N$394: R170.1 U$10.P$15(CR6)
N$395: R172.1 U$10.P$13(CR4)
N$396: R174.1 U$10.P$11(CR2)
N$397: R176.1 U$10.P$9(CR0)
N$398: R178.1 U$10.P$22(CG6)
N$399: R180.1 U$10.P$24(CG4)
N$400: R182.1 U$10.P$26(CG2)
N$401: R184.1 U$10.P$28(CG0)
N$402: R186.1 U$10.P$7(CB6)
N$403: R188.1 U$10.P$5(CB4)
N$404: R190.1 U$10.P$3(CB2)
N$405: R192.1 U$10.P$1(CB0)
N$406: IC17.3(SER_IN) IC18.18(SER_OUT)
N$407: IC16.3(SER_IN) IC17.18(SER_OUT)
N$408: IC13.18(SER_OUT) IC18.3(SER_IN)
N$409: Q8.G R193.2 R201.2
N$410: Q7.G R194.2 R202.2
N$411: Q6.G R195.2 R203.2
N$412: Q5.G R196.2 R204.2
N$413: Q4.G R197.2 R205.2
N$414: Q3.G R198.2 R206.2
N$415: Q2.G R199.2 R207.2
N$416: Q1.G R200.2 R208.2
N$417: IC25.15(QA) JP3.8 R193.1 S1.4 S1.5
N$419: IC25.1(QB) JP3.7 R194.1 S1.3 S1.6
N$421: IC25.3(QD) JP3.5 R196.1 S1.1 S1.8
N$422: IC25.4(QE) JP3.4 R197.1 S3.4 S3.5
N$423: IC25.5(QF) JP3.3 R198.1 S3.3 S3.6
N$425: IC25.7(QH) JP3.1 R200.1 S3.1 S3.8
N$426: IC16.18(SER_OUT) IC25.14(SER) S2.4 S2.7
N$427: IC25.6(QG) JP3.2 R199.1 S3.2 S3.7
N$428: IC25.2(QC) JP3.6 R195.1 S1.2 S1.7
R0: Q8.D U$1.P$17(A0) U$2.P$17(A0) U$3.P$32(A7) U$4.P$32(A7) U$7.P$17(A0) U$8.P$17(A0) U$9.P$32(A7) U$10.P$32(A7)
R1: Q7.D U$1.P$18(A1) U$2.P$18(A1) U$3.P$31(A6) U$4.P$31(A6) U$7.P$18(A1) U$8.P$18(A1) U$9.P$31(A6) U$10.P$31(A6)
R2: Q6.D U$1.P$19(A2) U$2.P$19(A2) U$3.P$30(A5) U$4.P$30(A5) U$7.P$19(A2) U$8.P$19(A2) U$9.P$30(A5) U$10.P$30(A5)
R3: Q5.D U$1.P$20(A3) U$2.P$20(A3) U$3.P$29(A4) U$4.P$29(A4) U$7.P$20(A3) U$8.P$20(A3) U$9.P$29(A4) U$10.P$29(A4)
R4: Q4.D U$1.P$29(A4) U$2.P$29(A4) U$3.P$20(A3) U$4.P$20(A3) U$7.P$29(A4) U$8.P$29(A4) U$9.P$20(A3) U$10.P$20(A3)
R5: Q3.D U$1.P$30(A5) U$2.P$30(A5) U$3.P$19(A2) U$4.P$19(A2) U$7.P$30(A5) U$8.P$30(A5) U$9.P$19(A2) U$10.P$19(A2)
R6: Q2.D U$1.P$31(A6) U$2.P$31(A6) U$3.P$18(A1) U$4.P$18(A1) U$7.P$31(A6) U$8.P$31(A6) U$9.P$18(A1) U$10.P$18(A1)
R7: Q1.D U$1.P$32(A7) U$2.P$32(A7) U$3.P$17(A0) U$4.P$17(A0) U$7.P$32(A7) U$8.P$32(A7) U$9.P$17(A0) U$10.P$17(A0)
VCC: C1.1 C2.1 C3.1 C4.1 C5.1 C6.1 C7.1 C8.1 C9.1 C10.1 C11.1 C12.1 C13.1 C14.1 C15.1 C16.1 C17.1 C18.1 C19.1 C20.1 C21.1 C22.1 C23.1 C24.1 C25.1 IC1.2(VCC) IC1.8(!SRCLR) IC2.2(VCC) IC2.8(!SRCLR) IC3.2(VCC) IC3.8(!SRCLR) IC4.2(VCC) IC4.8(!SRCLR) IC5.2(VCC) IC5.8(!SRCLR) IC6.2(VCC) IC6.8(!SRCLR) IC7.2(VCC) IC7.8(!SRCLR) IC8.2(VCC) IC8.8(!SRCLR) IC9.2(VCC) IC9.8(!SRCLR) IC10.2(VCC) IC10.8(!SRCLR) IC11.2(VCC) IC11.8(!SRCLR) IC12.2(VCC) IC12.8(!SRCLR) IC13.2(VCC) IC13.8(!SRCLR) IC14.2(VCC) IC14.8(!SRCLR) IC15.2(VCC) IC15.8(!SRCLR) IC16.2(VCC) IC16.8(!SRCLR) IC17.2(VCC) IC17.8(!SRCLR) IC18.2(VCC) IC18.8(!SRCLR) IC19.2(VCC) IC19.8(!SRCLR) IC20.2(VCC) IC20.8(!SRCLR) IC21.2(VCC) IC21.8(!SRCLR) IC22.2(VCC) IC22.8(!SRCLR) IC23.2(VCC) IC23.8(!SRCLR) IC24.2(VCC) IC24.8(!SRCLR) IC25.10(SCL) JP1.4 Q1.S Q2.S Q3.S Q4.S Q5.S Q6.S Q7.S Q8.S R201.1 R202.1 R203.1 R204.1 R205.1 R206.1 R207.1 R208.1 S2.5 S2.6
Unconnected: IC25.9(QH*)

## Buses
ROWS:R0,R1,R2,R3,R4,R5,R6,R7
MAIN:CLOCK,GND,LATCH,VCC

## Power pins joined to a net without a drawn wire
GND: IC25.8(GND)
VCC: IC25.16(VCC)

## Library data of the parts
C1-C25 = rcl:C-EU: CAPACITOR, European symbol; SPICEPREFIX: C
IC1-IC24 = TPIC6B595:TPIC6B595
IC25 = 74xx-eu:74*595: 8-bit SHIFT REGISTER, output latch
JP1 = pinhead:PINHD-1X5: PIN HEADER
JP3 = pinhead:PINHD-1X8: PIN HEADER
Q1-Q8 = transistor-power:IRF4905: P-Channel HEXFET® Power MOSFET RDS(on)= 0.02 Ohm, ID = -74A Source: http://www.irf.com/product-info/datasheets/data/irf4905pbf.pdf
R1-R208 = rcl:R-EU_: RESISTOR, European symbol; SPICEPREFIX: R
S1 S3 = switch-dil:DIP04YL: DIL/CODE SWITCH; OC_FARNELL: unknown; OC_NEWARK: unknown
S2 = switch-dil:DIP05YL: DIL/CODE SWITCH; OC_FARNELL: unknown; OC_NEWARK: unknown
U$1-U$4 U$7-U$10 = LED:2088-RGB-5